# Altium schematic sheet LED.SchDoc
size 431 x 279 mm; SheetNumber: 1; SheetTotal: 1
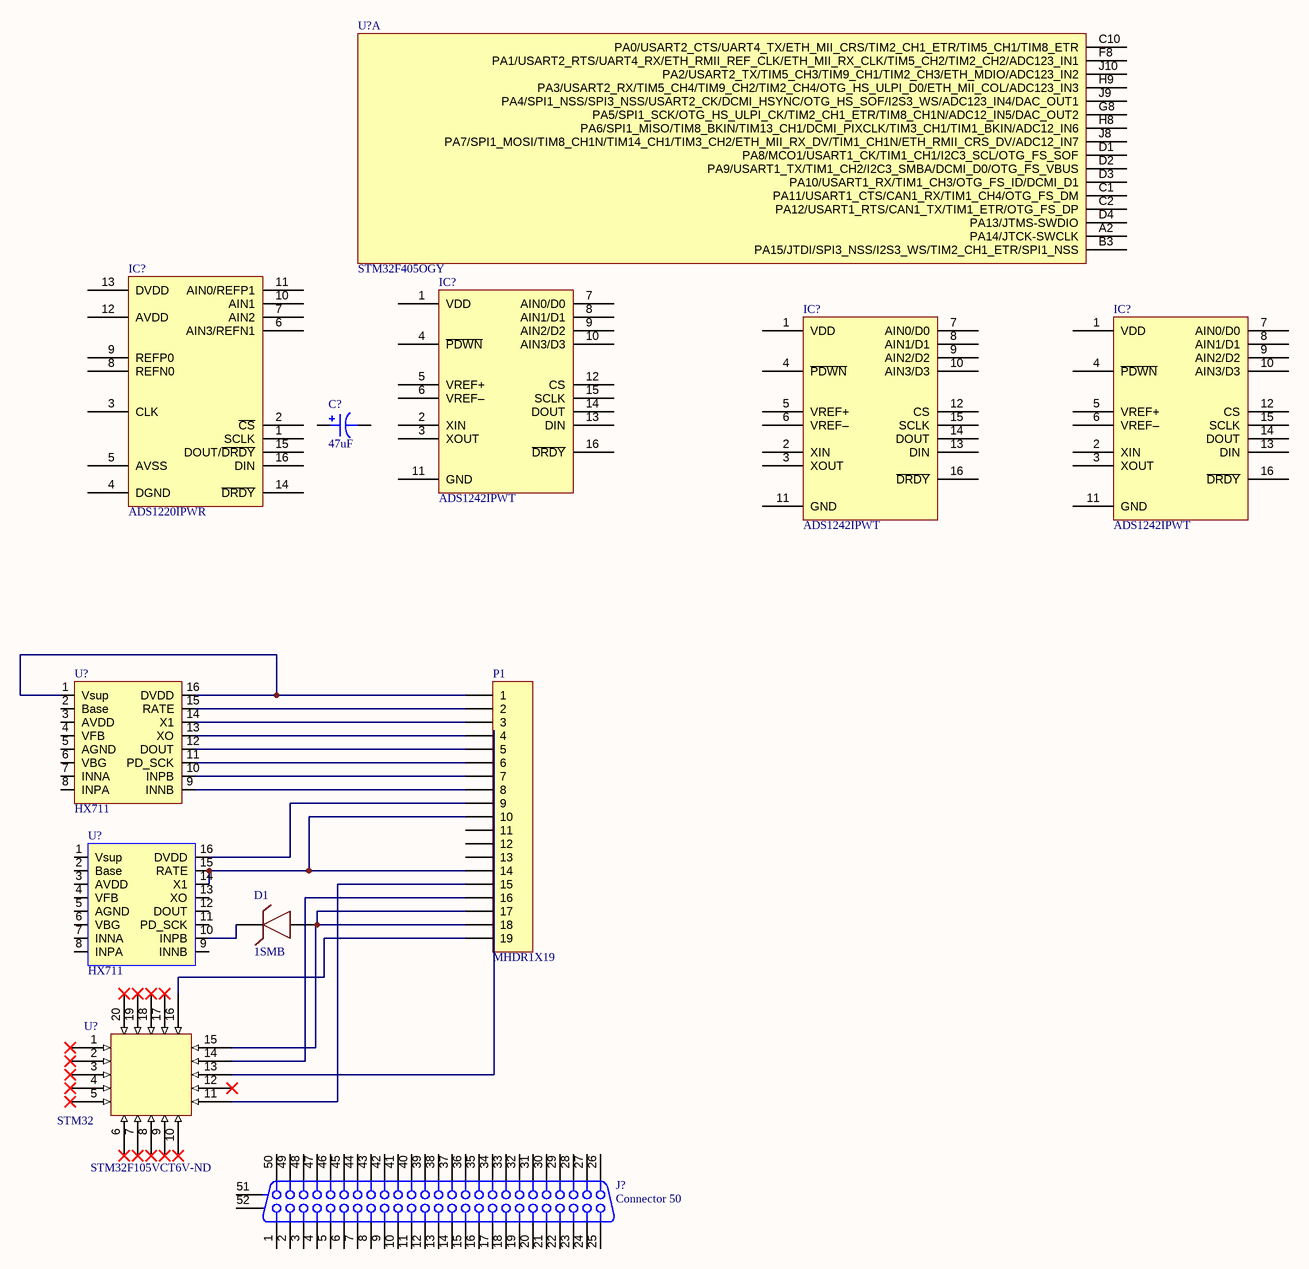
[diagram p0: LED.SchDoc]

## Parts
(Parts that share a designator on the sheet are numbered #1, #2 ... from top to bottom, then left to right.)
C?  47uF  [CAP ALUM 8.3MM]
D1  1SMB
IC?#1  ADS1220IPWR  [TI TSSOP-16 PW]
IC?#2  ADS1242IPWT  [TI TSSOP-16 PW]
IC?#3  ADS1242IPWT  [TI TSSOP-16 PW]
IC?#4  ADS1242IPWT  [TI TSSOP-16 PW]
J?  Connector 50  [CHAMP1.27-2H50]
P1  MHDR1X19  [MHDR1X19]
U?#1  STM32F405OGY  [STM-WLCSP90]  (part A of 8)
U?#2  HX711
U?#3  HX711
U?#4  STM32  Supplier Part Number 1: STM32F105VCT6V-ND

## Nets
NetD1_1: D1.1 U?#3.10(INPB)
NetD1_2: D1.2 P1.17 P1.18 U?#4.15
NetP1_1: P1.1 U?#2.1(Vsup) U?#2.16(DVDD)
NetP1_2: P1.2 U?#2.15(RATE)
NetP1_3: P1.3 U?#2.14(X1)
NetP1_4: P1.4 U?#2.13(XO)
NetP1_5: P1.5 U?#2.12(DOUT)
NetP1_6: P1.6 U?#2.11(PD_SCK)
NetP1_7: P1.7 U?#2.10(INPB)
NetP1_8: P1.8 U?#2.9(INNB)
NetP1_9: P1.9 U?#3.16(DVDD)
NetP1_10: P1.10 P1.14 U?#3.14(X1) U?#3.15(RATE)
NetP1_15: P1.15 U?#4.11
NetP1_16: P1.16 U?#4.14
NetP1_19: P1.19 U?#4.16

Not connected (* = marked no-connect by the designer): C? 1 2; IC?#1 1(SCLK) 2(~{CS}) 3(CLK) 4(DGND) 5(AVSS) 6(AIN3/REFN1) 7(AIN2) 8(REFN0) 9(REFP0) 10(AIN1) 11(AIN0/REFP1) 12(AVDD) 13(DVDD) 14(~{DRDY}) 15(DOUT/~{DRDY}) 16(DIN); IC?#2 1(VDD) 2(XIN) 3(XOUT) 4(~{PDWN}) 5(VREF+) 6(VREF–) 7(AIN0/D0) 8(AIN1/D1) 9(AIN2/D2) 10(AIN3/D3) 11(GND) 12(CS) 13(DIN) 14(DOUT) 15(SCLK) 16(~{DRDY}); IC?#3 1(VDD) 2(XIN) 3(XOUT) 4(~{PDWN}) 5(VREF+) 6(VREF–) 7(AIN0/D0) 8(AIN1/D1) 9(AIN2/D2) 10(AIN3/D3) 11(GND) 12(CS) 13(DIN) 14(DOUT) 15(SCLK) 16(~{DRDY}); IC?#4 1(VDD) 2(XIN) 3(XOUT) 4(~{PDWN}) 5(VREF+) 6(VREF–) 7(AIN0/D0) 8(AIN1/D1) 9(AIN2/D2) 10(AIN3/D3) 11(GND) 12(CS) 13(DIN) 14(DOUT) 15(SCLK) 16(~{DRDY}); J? 1 2 3 4 5 6 7 8 9 10 11 12 13 14 15 16 17 18 19 20 21 22 23 24 25 26 27 28 29 30 31 32 33 34 35 36 37 38 39 40 41 42 43 44 45 46 47 48 49 50 51(MH1) 52(MH2); P1 11 12 13; U?#1 A2(PA14/JTCK-SWCLK) B3(PA15/JTDI/SPI3_NSS/I2S3_WS/TIM2_CH1_ETR/SPI1_NSS) C1(PA11/USART1_CTS/CAN1_RX/TIM1_CH4/OTG_FS_DM) C2(PA12/USART1_RTS/CAN1_TX/TIM1_ETR/OTG_FS_DP) C10(PA0/USART2_CTS/UART4_TX/ETH_MII_CRS/TIM2_CH1_ETR/TIM5_CH1/TIM8_ETR) D1(PA8/MCO1/USART1_CK/TIM1_CH1/I2C3_SCL/OTG_FS_SOF) D2(PA9/USART1_TX/TIM1_CH2/I2C3_SMBA/DCMI_D0/OTG_FS_VBUS) D3(PA10/USART1_RX/TIM1_CH3/OTG_FS_ID/DCMI_D1) D4(PA13/JTMS-SWDIO) F8(PA1/USART2_RTS/UART4_RX/ETH_RMII_REF_CLK/ETH_MII_RX_CLK/TIM5_CH2/TIM2_CH2/ADC123_IN1) G8(PA5/SPI1_SCK/OTG_HS_ULPI_CK/TIM2_CH1_ETR/TIM8_CH1N/ADC12_IN5/DAC_OUT2) H8(PA6/SPI1_MISO/TIM8_BKIN/TIM13_CH1/DCMI_PIXCLK/TIM3_CH1/TIM1_BKIN/ADC12_IN6) H9(PA3/USART2_RX/TIM5_CH4/TIM9_CH2/TIM2_CH4/OTG_HS_ULPI_D0/ETH_MII_COL/ADC123_IN3) J8(PA7/SPI1_MOSI/TIM8_CH1N/TIM14_CH1/TIM3_CH2/ETH_MII_RX_DV/TIM1_CH1N/ETH_RMII_CRS_DV/ADC12_IN7) J9(PA4/SPI1_NSS/SPI3_NSS/USART2_CK/DCMI_HSYNC/OTG_HS_SOF/I2S3_WS/ADC123_IN4/DAC_OUT1) J10(PA2/USART2_TX/TIM5_CH3/TIM9_CH1/TIM2_CH3/ETH_MDIO/ADC123_IN2); U?#2 2(Base) 3(AVDD) 4(VFB) 5(AGND) 6(VBG) 7(INNA) 8(INPA); U?#3 1(Vsup) 2(Base) 3(AVDD) 4(VFB) 5(AGND) 6(VBG) 7(INNA) 8(INPA) 9(INNB) 11(PD_SCK) 12(DOUT) 13(XO); U?#4 1* 2* 3* 4* 5* 6* 7* 8* 9* 10* 12* 13 17* 18* 19* 20*

## Notes on the sheet
- DWG. NO.
- REV.
- SHT.
- THIS DOCUMENT AND THE DATA DISCLOSED HEREIN OR HEREWITH IS THE PROPERTY OF ALTIUM LIMITED AND MAY BE FREELY DISTRIBUTED IN WHOLE. NO RIGHTS ARE RESERVED OR EXPRESS OR IMPLIED WARANTEE GIVEN.
- REVISION
- DESCRIPTION
- DATE
- APPROVED
- ENG:
- APPROVALS
- PROJECT
- DSN:
- CHK:
- REFERENCE DOCUMENTS
- PROJECT REVISION:
- TITLE
- DOCUMENT REVISION:
- DESIGN ITEM:
- BOM:
- FAB DWG:
- PCB DWG:
- ASSY DWG:
- SCALE:
- SIZE
- B
- CAGE CODE
- FILE NAME
- DWG NO.
- SHEET
- OF
- REV

## Library data of the parts
C? = EEE-1HA470UP: CAP ALUM 47UF 20% 50V SMD; Manufacturer: Panasonic Electronic Components; TemperatureRange: -40C ~ 85C; Type: Automotive; Ripple Current: 110mA; Lifetime @ Temp: 2000 Hrs @ 85C; Value: 47uF; Part Number: EEE-1HA470UP; PartId: 7339; Supplier 1: Digi-Key; Supplier Part Number 1: PCE3928TR-ND; ComponentLink1Description: Datasheet; ComponentLink1URL: http://media.digikey.com/pdf/Data%20Sheets/Panasonic%20Electronic%20Components/S_Series_Type_V.pdf; ComponentLink2Description: Digi-Key listing; ComponentLink2URL: http://digikey.com/product-detail/en/EEE-1HA470UP/PCE3928TR-ND/766095; Tolerance: 20%; Voltage: 50V; Price: 0.2682; Device Package: Radial, Can - SMD; Impedance: -
IC?#1 = ADS1220IPWR: IC ADC 24-BIT 2KSPS 16-TSSOP; Manufacturer: Texas Instruments; Number of Bits: 24; Samping Rate: 2k; Number of Inputs: 2, 4; Input Type: Differential, Single Ended; Data Interface: SPI; Configuration: MUX-PGA-ADC; Number of A/D Converters: 1; Architecture: Sigma-Delta; Reference Type: External, Internal; Voltage - Supply, Analog: 2.3 V ~ 5.5 V; Part Number: ADS1220IPWR; PartId: 15702; Supplier 1: Digi-Key; Supplier Part Number 1: 296-39851-1-ND; ComponentLink1Description: Datasheet; ComponentLink1URL: http://www.ti.com/lit/ds/symlink/ads1220.pdf; ComponentLink2Description: Digi-Key Listing; ComponentLink2URL: http://www.digikey.com/product-detail/en/texas-instruments/ADS1220IPWR/296-39851-1-ND/5177728; Price: 8.71; Type: ADC; Device Package: 16-TSSOP (0.173", 4.40mm Width); Series: -; Ratio - S/H:ADC: -; Voltage - Supply, Digital: 2.3 V ~ 5.5 V; Features: PGA, Temperature Sensor
IC?#2-IC?#4 = ADS1242IPWT: IC ADC 24-BIT SER PROGBL 16TSSOP; Manufacturer: Texas Instruments; Number of Bits: 24; Samping Rate: 15; Number of Inputs: 4; Input Type: Differential, Single Ended; Data Interface: SPI; Configuration: MUX-PGA-ADC; Number of A/D Converters: 1; Architecture: Sigma-Delta; Reference Type: External; Voltage - Supply, Analog: 2.7 V ~ 3.3 V, 5V; Voltage - Supply, Digital: 2.7 V ~ 5.25 V; Part Number: ADS1242IPWT; PartId: 9268; Supplier 1: Digi-Key; Supplier Part Number 1: ADS1242IPWTTR-ND; ComponentLink1Description: Datasheet; ComponentLink1URL: http://www.ti.com/lit/ds/symlink/ads1242.pdf; ComponentLink2Description: Digi-Key Listing; ComponentLink2URL: http://www.digikey.com/product-detail/en/ADS1242IPWT/ADS1242IPWTTR-ND/459348; Price: 6.9394; Device Package: 16-TSSOP (0.173", 4.40mm Width); Series: -; Ratio - S/H:ADC: -; Features: PGA
J? = Connector 50: Receptacle Header Assemby; PackageDocument: B; Positions: 50; Published: 15-Jun-2001; LatestRevisionDate: 17-Jul-2002; LatestRevisionNote: Re-released for DXP Platform.; DatasheetDocument: 1-Oct-1983; PackageReference: 178240-7; Publisher: Altium Limited; Orientation: Right Angle
P1 = MHDR1X19: Header, 19-Pin; LatestRevisionDate: 17-Jul-2002; LatestRevisionNote: Re-released for DXP Platform.; Publisher: Altium Limited
U?#1 = STM32F405OGY6: ARM® Cortex®-M4 series Microcontroller IC 32-Bit 168MHz 1MB (1M x 8) FLASH 90-WLCSP (4.22x3.97); Manufacturer: STMicroelectronics; Core: ARM Cortex-M4; FLASH Size (Prog) (kB): 1024; I/Os (High Current): 72; Internal RAM Size (kB): 192; Operating Frequency(F) (Processor speed) (MHz): 168; Supplier 1: Digi-Key; Supplier 2: Newark; Part Number: STM32F405OGY; ComponentLink1Description: Manufacturer URL; ComponentLink1URL: https://www.st.com/content/st_com/en/products/microcontrollers-microprocessors/stm32-32-bit-arm-cortex-mcus/stm32-high-performance-mcus/stm32f4-series/stm32f405-415/stm32f405og.html; Supplier Part Number 1: 497-17431-1-ND; Supplier Part Number 2: 66W7295
U?#2 U?#3 = HX711: HX711 Load cell Amplifiel; ComponentLink1Description: Datasheet; ComponentLink1URL: file:///D:/01.Working/Elektronik/Electronic-PCB-Altium-Project/PCB_Project_Test/Datasheet/dac716.pdf
D1 = 1SMB: ComponentLink1Description: Data; ComponentLink1URL: *D:\01.Working\Elektronik\Electronic-PCB-Altium-Project\PCB_Project_Test\Datasheet\1smb_diode.pdf
U?#4 = STM32: Supplier 1: Digi-Key